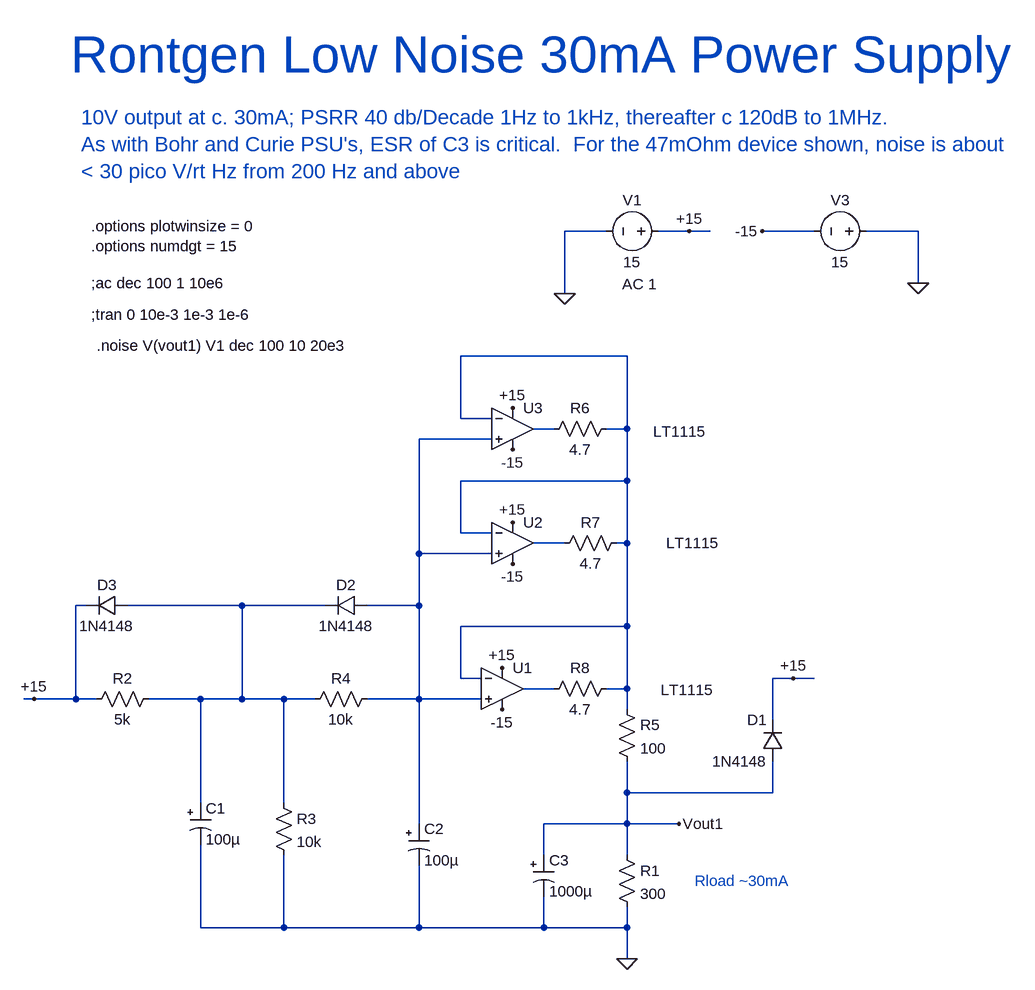
[diagram p0: schematic Rontgen.asc]
Rontgen.asc, the LTspice schematic file:
Version 4
SHEET 1 2724 680
WIRE 144 -576 80 -576
WIRE 272 -576 224 -576
WIRE 304 -576 272 -576
WIRE 464 -576 384 -576
WIRE 624 -576 544 -576
WIRE 624 -496 624 -576
WIRE 80 -480 80 -576
WIRE 176 -384 -80 -384
WIRE -80 -288 -80 -384
WIRE -32 -288 -80 -288
WIRE 64 -272 32 -272
WIRE 176 -272 176 -384
WIRE 176 -272 144 -272
WIRE -32 -256 -144 -256
WIRE 176 -192 176 -272
WIRE 176 -192 -80 -192
WIRE -80 -112 -80 -192
WIRE -32 -112 -80 -112
WIRE 80 -96 32 -96
WIRE 176 -96 176 -192
WIRE 176 -96 160 -96
WIRE -144 -80 -144 -256
WIRE -32 -80 -144 -80
WIRE -656 0 -672 0
WIRE -416 0 -592 0
WIRE -288 0 -416 0
WIRE -144 0 -144 -80
WIRE -144 0 -224 0
WIRE 176 32 176 -96
WIRE 176 32 -80 32
WIRE -80 112 -80 32
WIRE -48 112 -80 112
WIRE 432 112 400 112
WIRE 464 112 432 112
WIRE 64 128 16 128
WIRE 176 128 176 32
WIRE 176 128 144 128
WIRE -736 144 -752 144
WIRE -672 144 -672 0
WIRE -672 144 -736 144
WIRE -640 144 -672 144
WIRE -480 144 -560 144
WIRE -416 144 -416 0
WIRE -416 144 -480 144
WIRE -352 144 -416 144
WIRE -304 144 -352 144
WIRE -144 144 -144 0
WIRE -144 144 -224 144
WIRE -48 144 -144 144
WIRE 176 160 176 128
WIRE 400 176 400 112
WIRE 176 288 176 240
WIRE 400 288 400 240
WIRE 400 288 176 288
WIRE -480 304 -480 144
WIRE -352 304 -352 144
WIRE -144 336 -144 144
WIRE 176 336 176 288
WIRE 176 336 48 336
WIRE 256 336 176 336
WIRE 48 384 48 336
WIRE 176 384 176 336
WIRE -480 496 -480 368
WIRE -352 496 -352 384
WIRE -352 496 -480 496
WIRE -144 496 -144 400
WIRE -144 496 -352 496
WIRE 48 496 48 448
WIRE 48 496 -144 496
WIRE 176 496 176 464
WIRE 176 496 48 496
WIRE 176 544 176 496
FLAG 80 -480 0
FLAG 624 -496 0
FLAG 272 -576 +15
FLAG -16 96 +15
FLAG 384 -576 -15
FLAG -16 160 -15
FLAG 256 336 Vout1
FLAG 176 544 0
FLAG -736 144 +15
FLAG 0 -128 +15
FLAG 0 -64 -15
FLAG 0 -304 +15
FLAG 0 -240 -15
FLAG 432 112 +15
SYMBOL voltage 240 -576 R90
WINDOW 0 -32 56 VBottom 2
WINDOW 3 32 56 VTop 2
WINDOW 123 97 45 VBottom 2
WINDOW 39 0 0 Left 2
SYMATTR InstName V1
SYMATTR Value 15
SYMATTR Value2 AC 1
SYMBOL Opamps\\LT1115 -16 64 R0
WINDOW 3 244 66 Left 2
SYMATTR InstName U1
SYMBOL voltage 560 -576 R90
WINDOW 0 -32 56 VBottom 2
WINDOW 3 32 56 VTop 2
WINDOW 123 2 56 VBottom 2
WINDOW 39 0 0 Left 2
SYMATTR InstName V3
SYMATTR Value 15
SYMBOL res 160 368 R0
SYMATTR InstName R1
SYMATTR Value 300
SYMBOL res -544 128 R90
WINDOW 0 0 56 VBottom 2
WINDOW 3 32 56 VTop 2
SYMATTR InstName R2
SYMATTR Value 5k
SYMBOL res -368 288 R0
SYMATTR InstName R3
SYMATTR Value 10k
SYMBOL res -208 128 R90
WINDOW 0 0 56 VBottom 2
WINDOW 3 32 56 VTop 2
SYMATTR InstName R4
SYMATTR Value 10k
SYMBOL polcap -160 336 R0
WINDOW 3 24 56 Left 2
SYMATTR Value 100µ
SYMATTR InstName C2
SYMATTR Description Capacitor
SYMATTR Type cap
SYMATTR SpiceLine V=16 Irms=135m Rser=0.8 Lser=0 mfg="Nichicon" pn="UPR1C101MPH" type="Al electrolytic"
SYMBOL polcap -496 304 R0
WINDOW 3 24 56 Left 2
SYMATTR Value 100µ
SYMATTR InstName C1
SYMATTR Description Capacitor
SYMATTR Type cap
SYMATTR SpiceLine V=16 Irms=135m Rser=0.8 Lser=0 mfg="Nichicon" pn="UPR1C101MPH" type="Al electrolytic"
SYMBOL res 160 144 R0
SYMATTR InstName R5
SYMATTR Value 100
SYMBOL polcap 32 384 R0
WINDOW 3 24 56 Left 2
SYMATTR Value 1000µ
SYMATTR InstName C3
SYMATTR Description Capacitor
SYMATTR Type cap
SYMATTR SpiceLine V=16 Irms=1.41 Rser=0.047 Lser=0 mfg="Nichicon" pn="UPL1C102MPH" type="Al electrolytic"
SYMBOL Opamps\\LT1115 0 -160 R0
WINDOW 3 236 64 Left 2
SYMATTR InstName U2
SYMBOL Opamps\\LT1115 0 -336 R0
WINDOW 3 216 68 Left 2
SYMATTR InstName U3
SYMBOL res 160 -288 R90
WINDOW 0 0 56 VBottom 2
WINDOW 3 32 56 VTop 2
SYMATTR InstName R6
SYMATTR Value 4.7
SYMBOL res 176 -112 R90
WINDOW 0 0 56 VBottom 2
WINDOW 3 32 56 VTop 2
SYMATTR InstName R7
SYMATTR Value 4.7
SYMBOL res 160 112 R90
WINDOW 0 0 56 VBottom 2
WINDOW 3 32 56 VTop 2
SYMATTR InstName R8
SYMATTR Value 4.7
SYMBOL diode 416 240 R180
WINDOW 0 24 64 Left 2
WINDOW 3 24 0 Left 2
SYMATTR InstName D1
SYMATTR Value 1N4148
SYMBOL diode -224 -16 R90
WINDOW 0 0 32 VBottom 2
WINDOW 3 32 32 VTop 2
SYMATTR InstName D2
SYMATTR Value 1N4148
SYMBOL diode -592 -16 R90
WINDOW 0 0 32 VBottom 2
WINDOW 3 32 32 VTop 2
SYMATTR InstName D3
SYMATTR Value 1N4148
TEXT -648 -496 Left 2 !;ac dec 100 1 10e6
TEXT -648 -448 Left 2 !;tran 0 10e-3 1e-3 1e-6
TEXT -640 -400 Left 2 !.noise V(vout1) V1 dec 100 10 20e3
TEXT -648 -584 Left 2 !.options plotwinsize = 0\n.options numdgt = 15
TEXT -680 -848 Left 6 ;Rontgen Low Noise 30mA Power Supply
TEXT -664 -752 Left 3 ;10V output at c. 30mA; PSRR 40 db/Decade 1Hz to 1kHz, thereafter c 120dB to 1MHz.\nAs with Bohr and Curie PSU's, ESR of C3 is critical.  For the 47mOhm device shown, noise is about\n< 30 pico V/rt Hz from 200 Hz and above
TEXT 280 424 Left 2 ;Rload ~30mA

The netlist it stands for:
* Rontgen.asc
V1 +15 0 15 AC 1
XU1 N003 N001 +15 -15 N006 LT1028  ; LT1115, pins In+ In- V+ V- OUT
V3 0 -15 15
R1 Vout1 0 300
R2 N005 +15 5k
R3 N005 0 10k
R4 N003 N005 10k
C2 N003 0 100µ V=16 Irms=135m Rser=0.8 Lser=0 mfg="Nichicon" pn="UPR1C101MPH" type="Al electrolytic"
C1 N005 0 100µ V=16 Irms=135m Rser=0.8 Lser=0 mfg="Nichicon" pn="UPR1C101MPH" type="Al electrolytic"
R5 N001 Vout1 100
C3 Vout1 0 1000µ V=16 Irms=1.41 Rser=0.047 Lser=0 mfg="Nichicon" pn="UPL1C102MPH" type="Al electrolytic"
XU2 N003 N001 +15 -15 N004 LT1028  ; LT1115, pins In+ In- V+ V- OUT
XU3 N003 N001 +15 -15 N002 LT1028  ; LT1115, pins In+ In- V+ V- OUT
R6 N001 N002 4.7
R7 N001 N004 4.7
R8 N001 N006 4.7
D1 Vout1 +15 1N4148
D2 N003 N005 1N4148
D3 N005 +15 1N4148
.model D D
.lib standard.dio
;ac dec 100 1 10e6
;tran 0 10e-3 1e-3 1e-6
.noise V(vout1) V1 dec 100 10 20e3
.options plotwinsize = 0
.options numdgt = 15
* Rontgen Low Noise 30mA Power Supply
* 10V output at c. 30mA; PSRR 40 db/Decade 1Hz to 1kHz, thereafter c 120dB to 1MHz.
* As with Bohr and Curie PSU's, ESR of C3 is critical.  For the 47mOhm device shown, noise is about
* < 30 pico V/rt Hz from 200 Hz and above
* Rload ~30mA
.lib LTC.lib
.backanno
.end